# Altium project PCB_Project1.PrjPCB
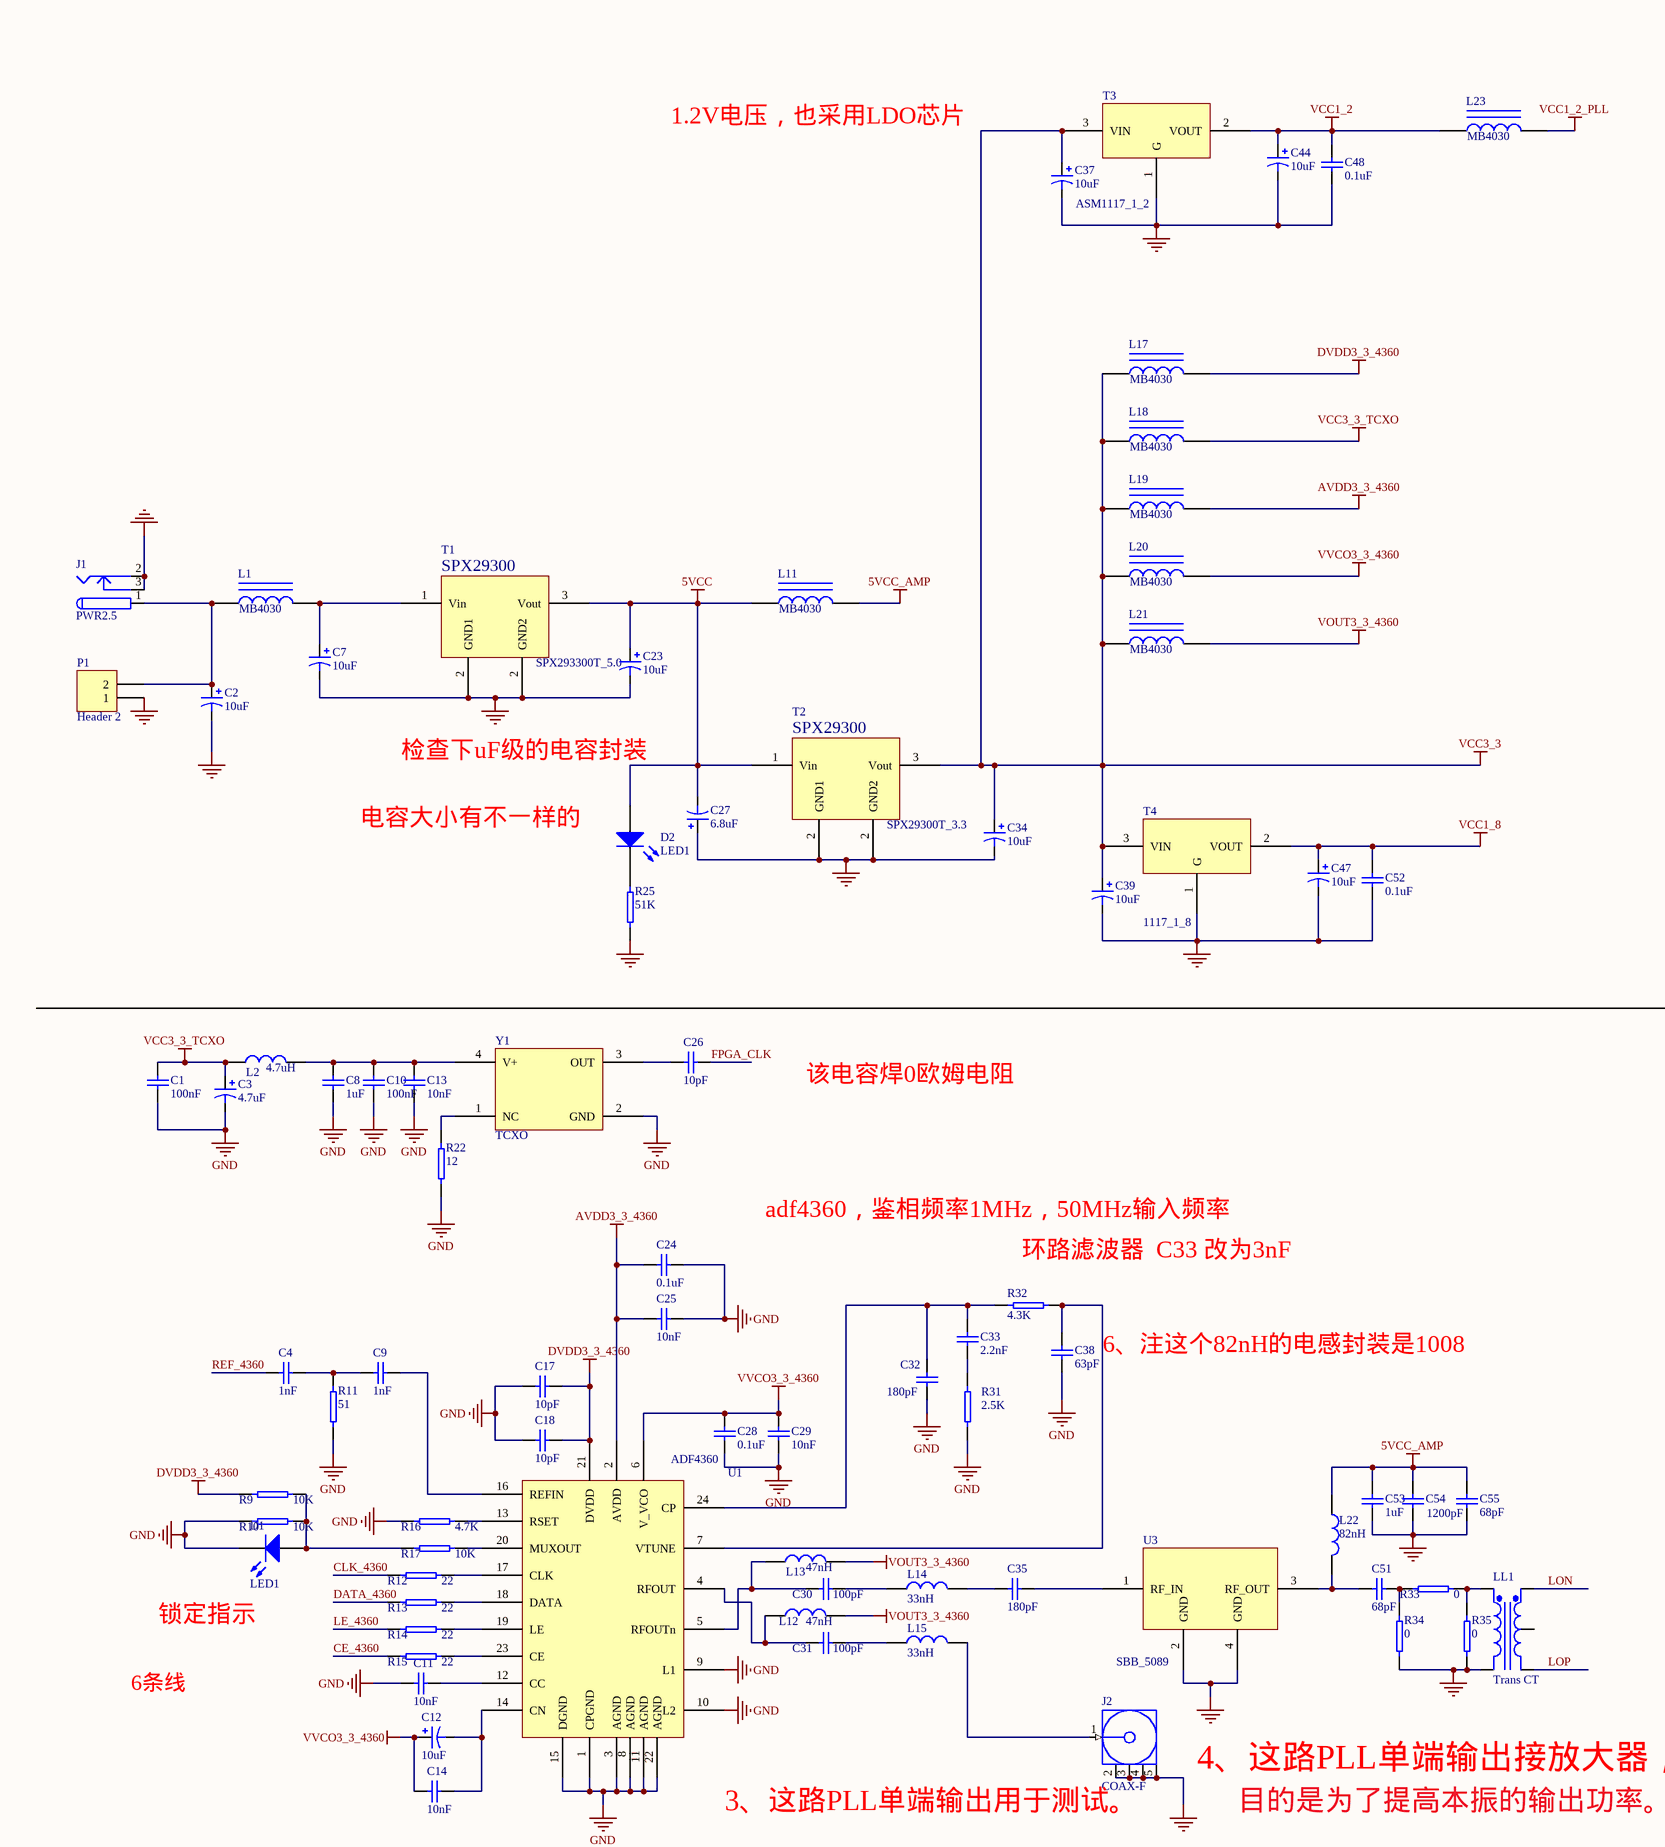
[diagram p0: Sheet1.SchDoc, top left]
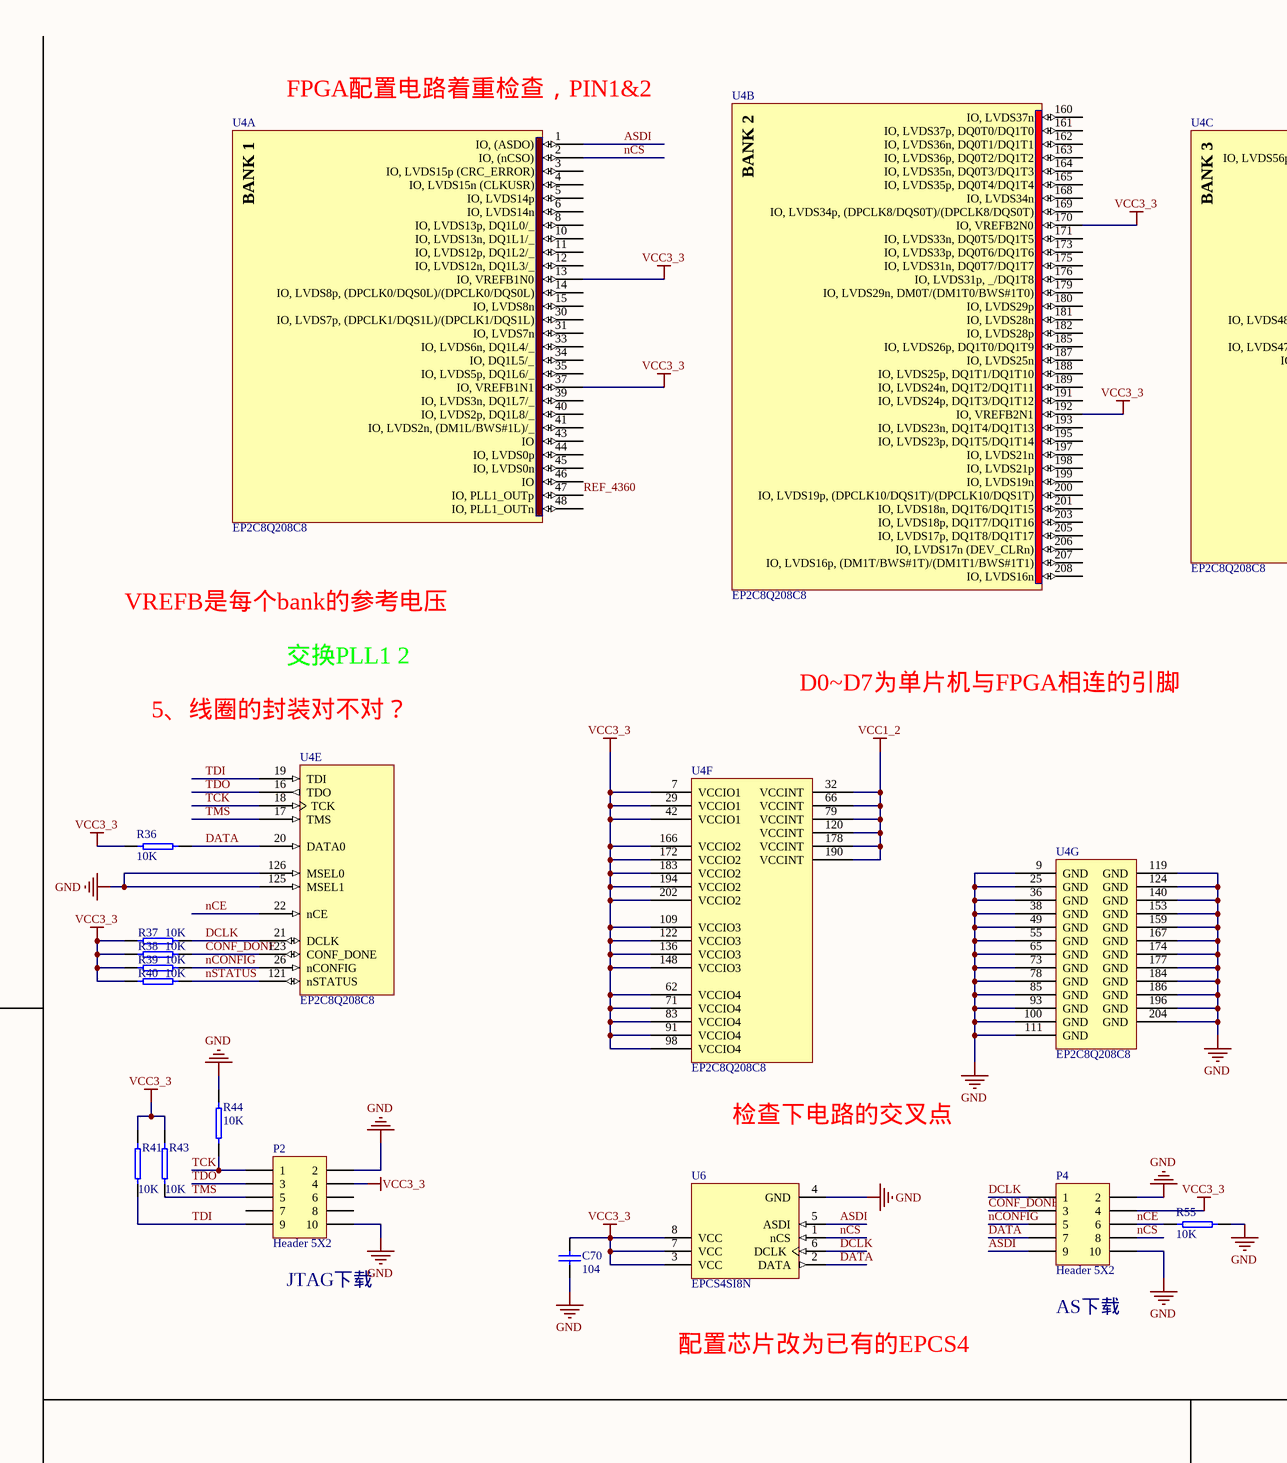
[diagram p1: Sheet1.SchDoc, top middle]
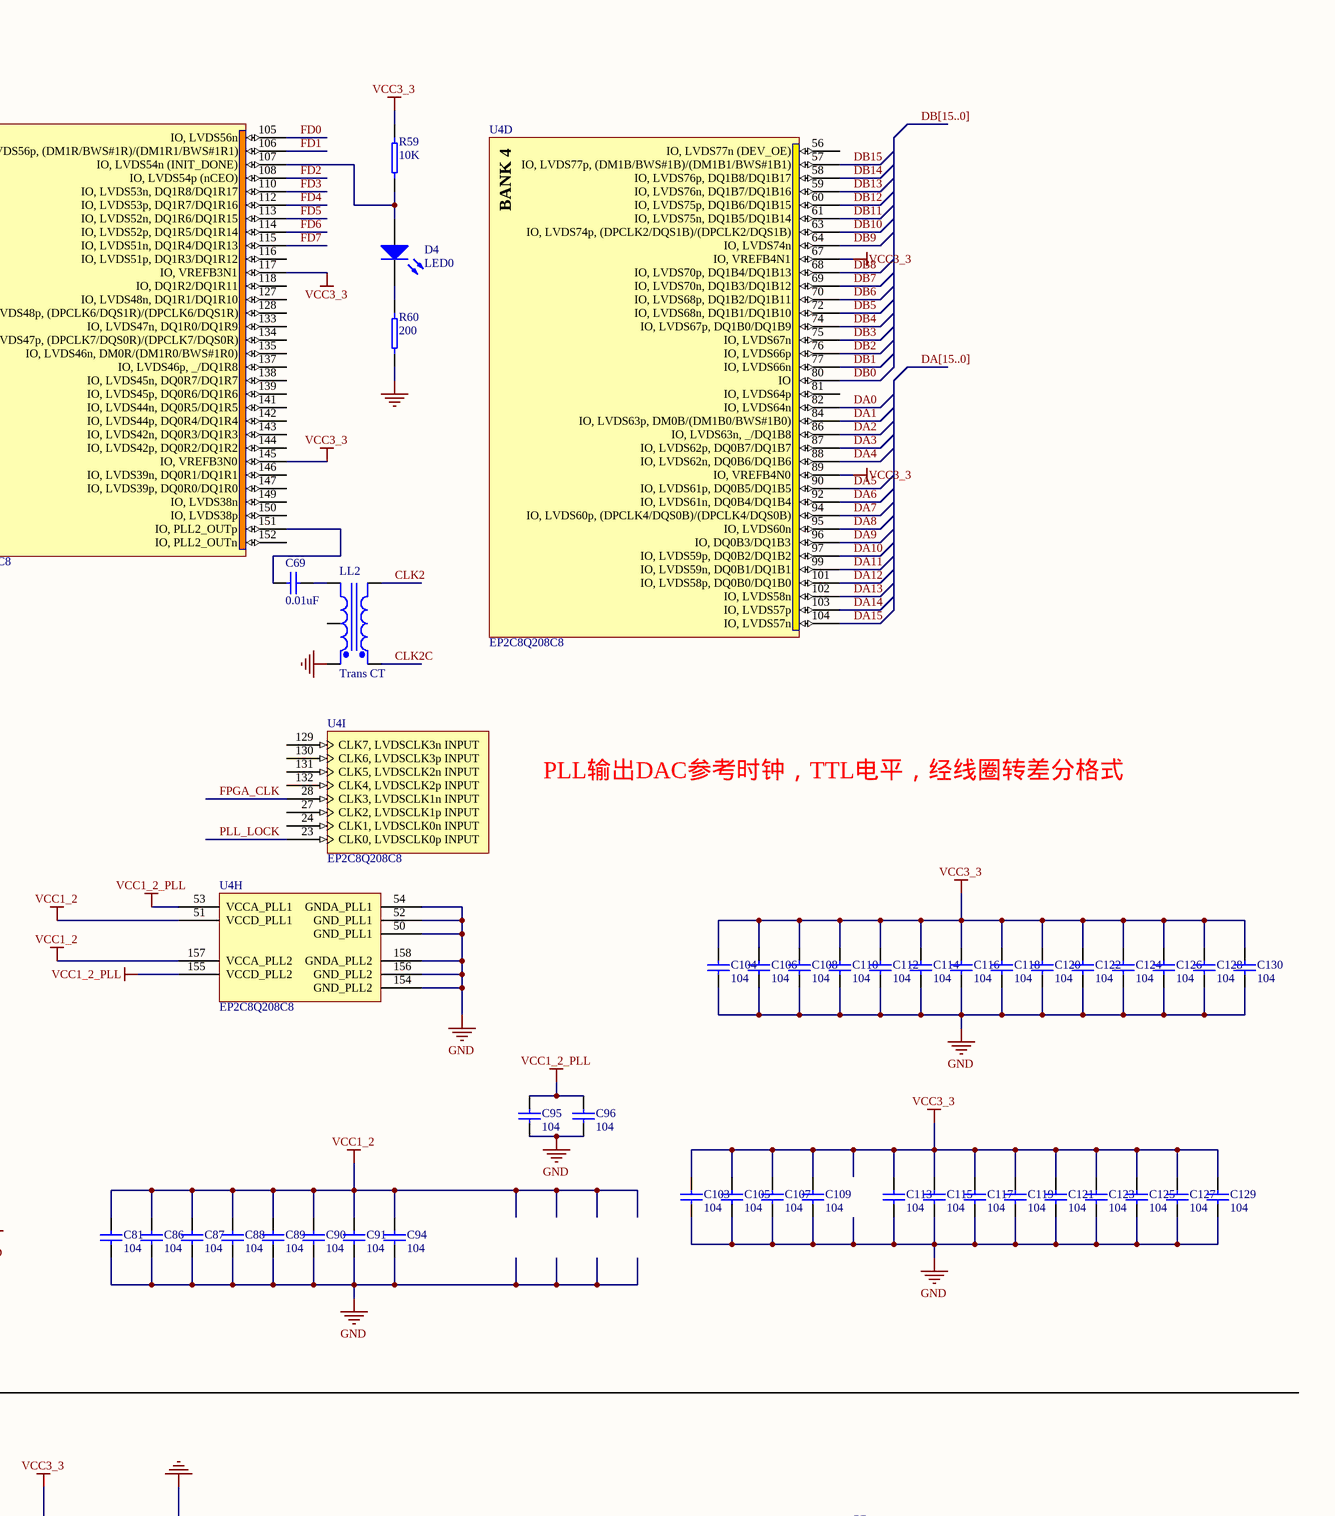
[diagram p2: Sheet1.SchDoc, top right]
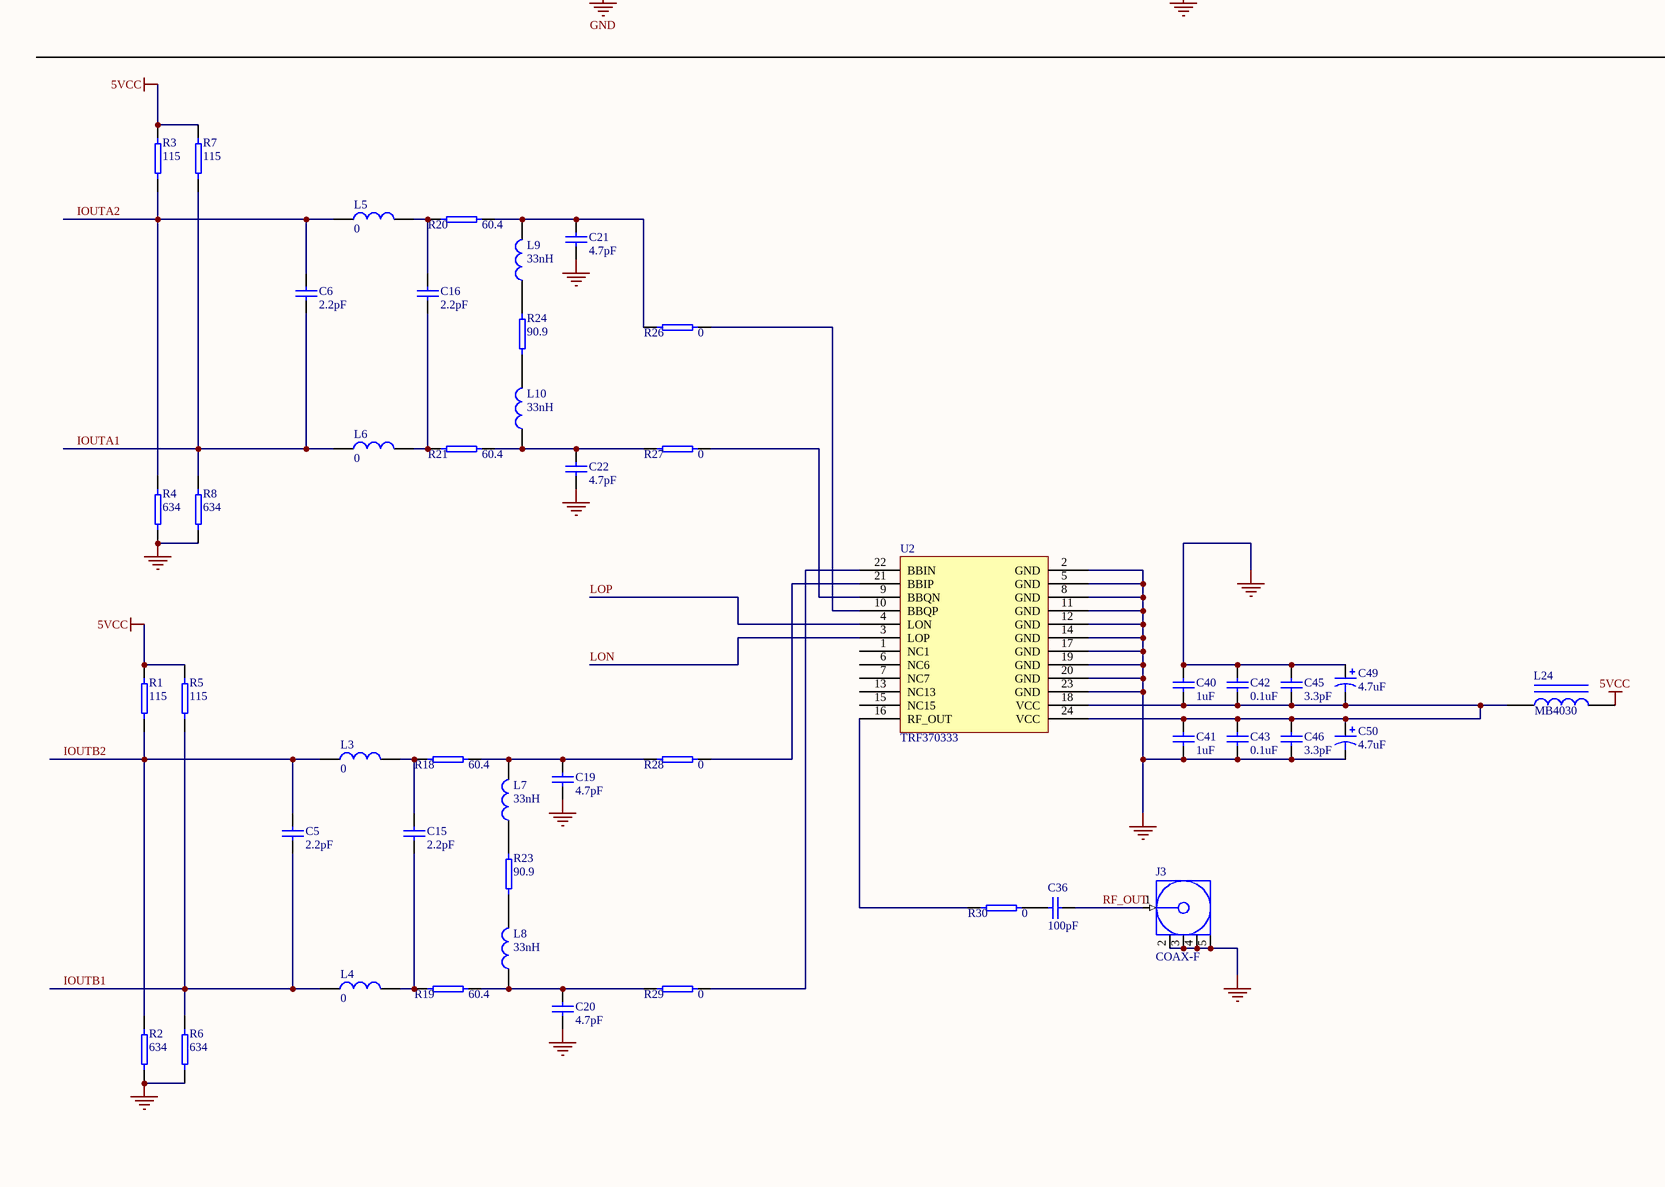
[diagram p3: Sheet1.SchDoc, bottom left]
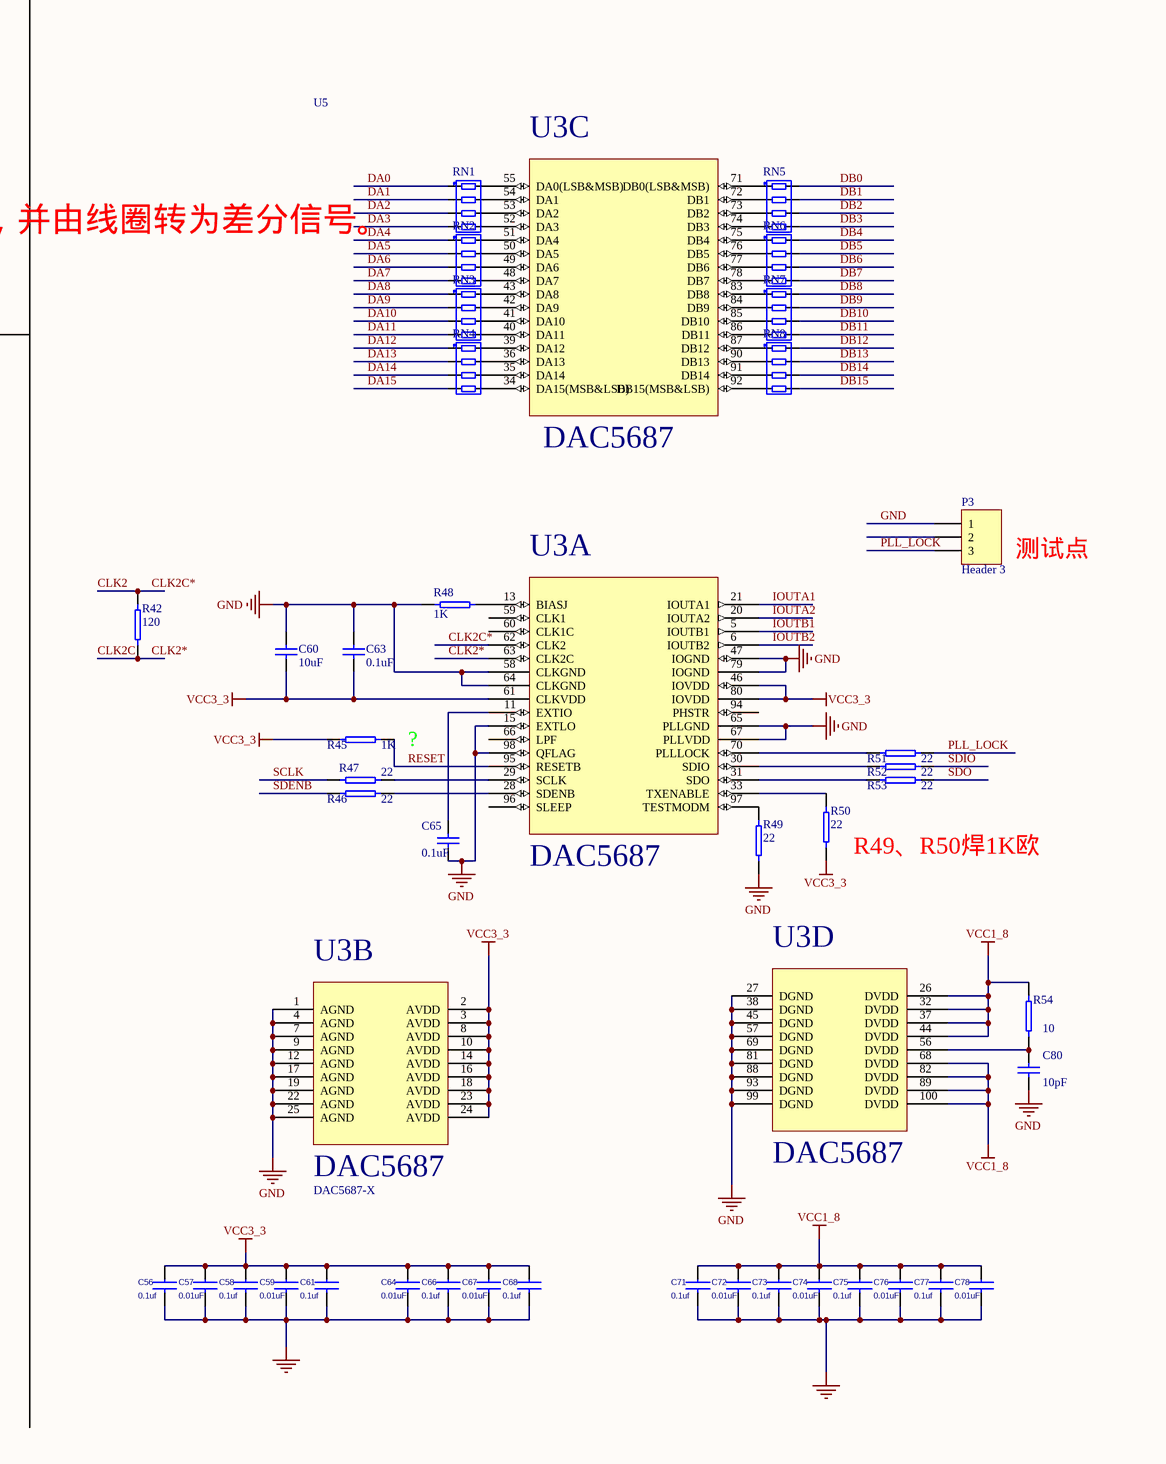
[diagram p4: Sheet1.SchDoc, bottom middle]
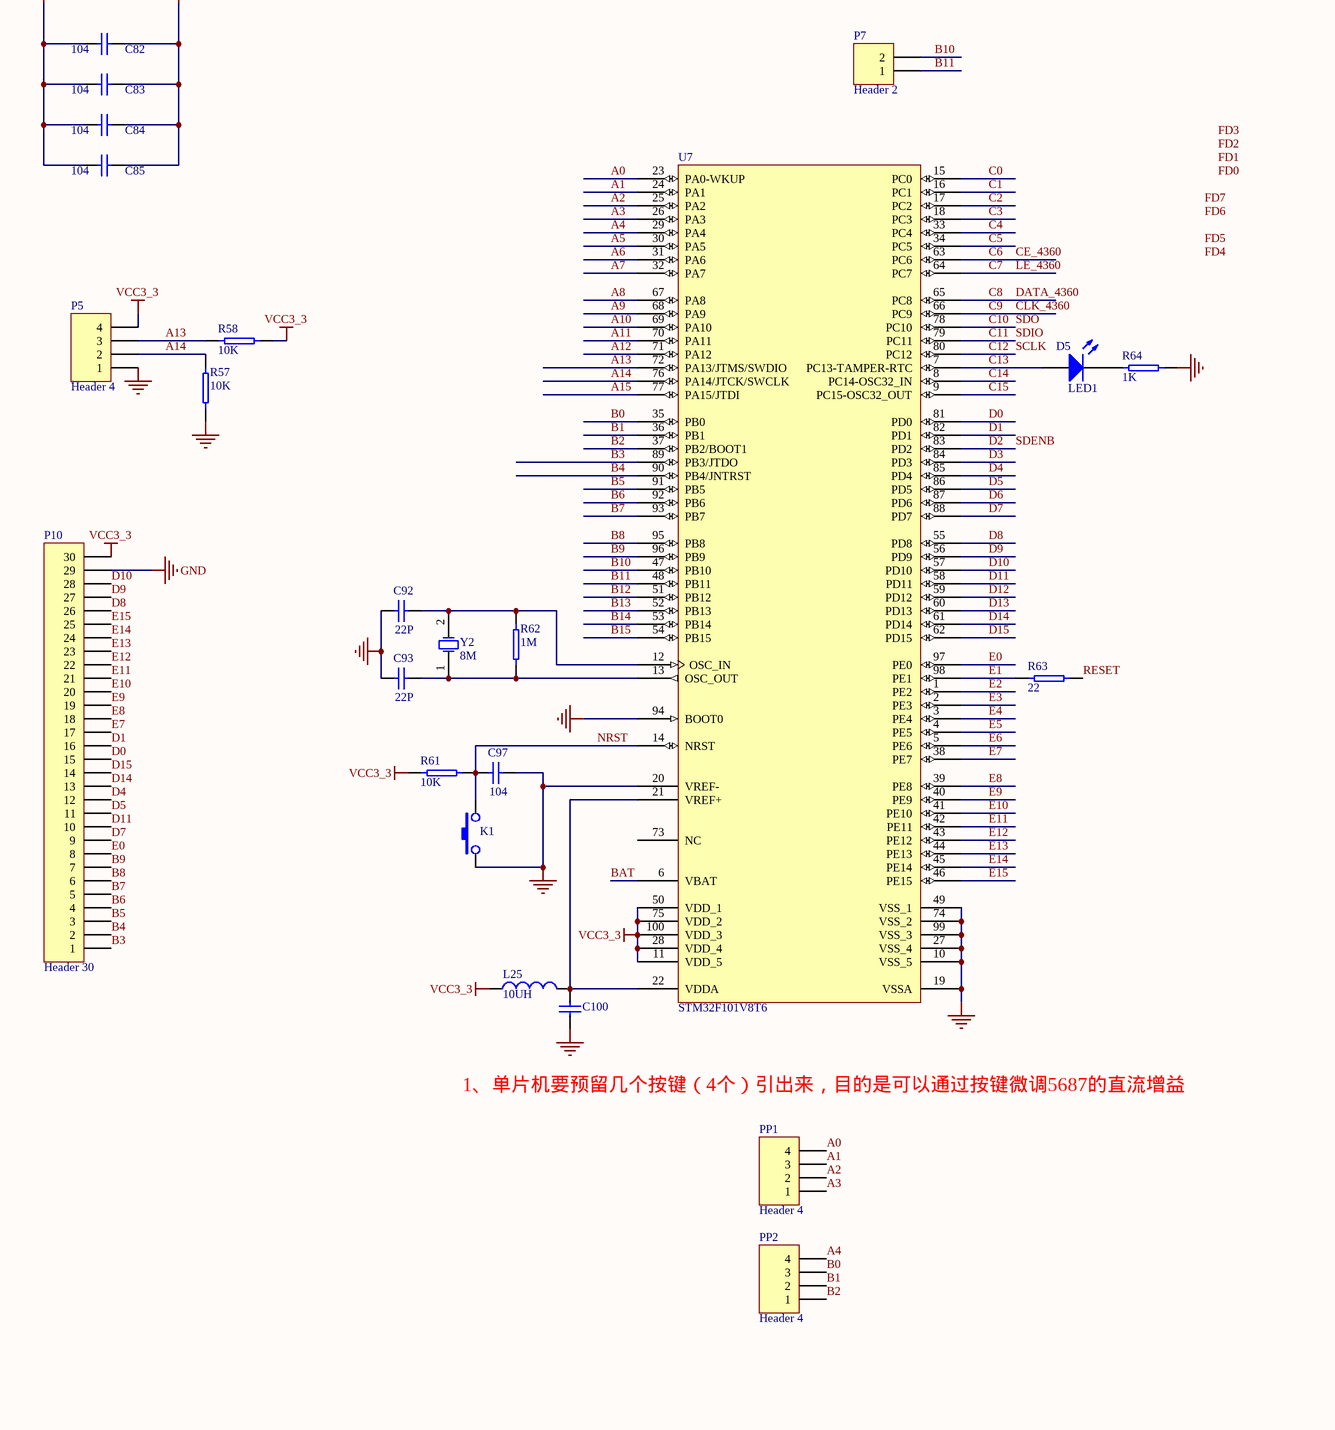
[diagram p5: Sheet1.SchDoc, bottom right]
1 sheet, 250 parts. Net scope: global (net labels, ports and power ports of the same name join across sheets).
Board file: PCB1.PcbDoc

## Sheet Sheet1.SchDoc
size A1

### Parts
C1  value 100nF  [0805C]  (hidden comment: Cap)
C2  10uF  [1206]
C3  4.7uF  [1206]
C4  value 1nF  [0805C]  (hidden comment: Cap)
C5  value 2.2pF  [0805C]  (hidden comment: Cap)
C6  value 2.2pF  [0805C]  (hidden comment: Cap)
C7  10uF  [1206]
C8  value 1uF  [0805C]  (hidden comment: Cap)
C9  value 1nF  [0805C]  (hidden comment: Cap)
C10  value 100nF  [0805C]  (hidden comment: Cap)
C11  value 10nF  [0805C]  (hidden comment: Cap)
C12  10uF  [1206]
C13  value 10nF  [0805C]  (hidden comment: Cap)
C14  value 10nF  [0805C]  (hidden comment: Cap)
C15  value 2.2pF  [0805C]  (hidden comment: Cap)
C16  value 2.2pF  [0805C]  (hidden comment: Cap)
C17  value 10pF  [0805C]  (hidden comment: Cap)
C18  value 10pF  [0805C]  (hidden comment: Cap)
C19  value 4.7pF  [0805C]  (hidden comment: Cap)
C20  value 4.7pF  [0805C]  (hidden comment: Cap)
C21  value 4.7pF  [0805C]  (hidden comment: Cap)
C22  value 4.7pF  [0805C]  (hidden comment: Cap)
C23  10uF  [1206]
C24  value 0.1uF  [0805C]  (hidden comment: Cap)
C25  value 10nF  [0805C]  (hidden comment: Cap)
C26  value 10pF  [0805C]  (hidden comment: Cap)
C27  6.8uF  [1206]
C28  value 0.1uF  [0805C]  (hidden comment: Cap)
C29  value 10nF  [0805C]  (hidden comment: Cap)
C30  value 100pF  [0805C]  (hidden comment: Cap)
C31  value 100pF  [0805C]  (hidden comment: Cap)
C32  value 180pF  [0805C]  (hidden comment: Cap)
C33  value 2.2nF  [0805C]  (hidden comment: Cap)
C34  10uF  [1206]
C35  value 180pF  [0805C]  (hidden comment: Cap)
C36  value 100pF  [0805C]  (hidden comment: Cap)
C37  10uF  [1206]
C38  value 63pF  [0805C]  (hidden comment: Cap)
C39  10uF  [1206]
C40  value 1uF  [0805C]  (hidden comment: Cap)
C41  value 1uF  [0805C]  (hidden comment: Cap)
C42  value 0.1uF  [0805C]  (hidden comment: Cap)
C43  value 0.1uF  [0805C]  (hidden comment: Cap)
C44  10uF  [1206]
C45  value 3.3pF  [0805C]  (hidden comment: Cap)
C46  value 3.3pF  [0805C]  (hidden comment: Cap)
C47  10uF  [1206]
C48  value 0.1uF  [0805C]  (hidden comment: Cap)
C49  4.7uF  [1206]
C50  4.7uF  [1206]
C51  value 68pF  [0805C]  (hidden comment: Cap)
C52  value 0.1uF  [0805C]  (hidden comment: Cap)
C53  value 1uF  [0805C]  (hidden comment: Cap)
C54  value 1200pF  [0805C]  (hidden comment: Cap)
C55  value 68pF  [0805C]  (hidden comment: Cap)
C56  0.1uf  [0603]
C57  0.01uF  [0603]
C58  0.1uf  [0603]
C59  0.01uF  [0603]
C60  value 10uF  [0805C]  (hidden comment: Cap)
C61  0.1uf  [0603]
C63  value 0.1uF  [0805C]  (hidden comment: Cap)
C64  0.01uF  [0603]
C65  value 0.1uF  [0805C]  (hidden comment: Cap)
C66  0.1uf  [0603]
C67  0.01uF  [0603]
C68  0.1uf  [0603]
C69  value 0.01uF  [0805C]  (hidden comment: Cap)
C70  value 104  [0805C]  (hidden comment: Cap)
C71  0.1uf  [0603]
C72  0.01uF  [0603]
C73  0.1uf  [0603]
C74  0.01uF  [0603]
C75  0.1uf  [0603]
C76  0.01uF  [0603]
C77  0.1uf  [0603]
C78  0.01uF  [0603]
C80  value 10pF  [0805C]  (hidden comment: Cap)
C81  value 104  [0603]  (hidden comment: Cap)
C82  104  [0805C]
C83  104  [0805C]
C84  104  [0805C]
C85  104  [0805C]
C86  value 104  [0603]  (hidden comment: Cap)
C87  value 104  [0603]  (hidden comment: Cap)
C88  value 104  [0603]  (hidden comment: Cap)
C89  value 104  [0603]  (hidden comment: Cap)
C90  value 104  [0603]  (hidden comment: Cap)
C91  value 104  [0603]  (hidden comment: Cap)
C92  value 22P  [0805C]  (hidden comment: Cap)
C93  value 22P  [0805C]  (hidden comment: Cap)
C94  value 104  [0603]  (hidden comment: Cap)
C95  value 104  [0603]  (hidden comment: Cap)
C96  value 104  [0603]  (hidden comment: Cap)
C97  value 104  [0805C]  (hidden comment: Cap)
C100  Cap  [0805C]  (value not drawn)
C103  value 104  [0603]  (hidden comment: Cap)
C104  value 104  [0603]  (hidden comment: Cap)
C105  value 104  [0603]  (hidden comment: Cap)
C106  value 104  [0603]  (hidden comment: Cap)
C107  value 104  [0603]  (hidden comment: Cap)
C108  value 104  [0603]  (hidden comment: Cap)
C109  value 104  [0603]  (hidden comment: Cap)
C110  value 104  [0603]  (hidden comment: Cap)
C112  value 104  [0603]  (hidden comment: Cap)
C113  value 104  [0603]  (hidden comment: Cap)
C114  value 104  [0603]  (hidden comment: Cap)
C115  value 104  [0603]  (hidden comment: Cap)
C116  value 104  [0603]  (hidden comment: Cap)
C117  value 104  [0603]  (hidden comment: Cap)
C118  value 104  [0603]  (hidden comment: Cap)
C119  value 104  [0603]  (hidden comment: Cap)
C120  value 104  [0603]  (hidden comment: Cap)
C121  value 104  [0603]  (hidden comment: Cap)
C122  value 104  [0603]  (hidden comment: Cap)
C123  value 104  [0603]  (hidden comment: Cap)
C124  value 104  [0603]  (hidden comment: Cap)
C125  value 104  [0603]  (hidden comment: Cap)
C126  value 104  [0603]  (hidden comment: Cap)
C127  value 104  [0603]  (hidden comment: Cap)
C128  value 104  [0603]  (hidden comment: Cap)
C129  value 104  [0603]  (hidden comment: Cap)
C130  value 104  [0603]  (hidden comment: Cap)
D1  LED1  [0805D]
D2  LED1  [0805D]
D4  LED0  [0805D]
D5  LED1  [0805D]
J1  PWR2.5  [DS-3]
J2  COAX-F  [MCX5.08-H5]
J3  COAX-F  [MCX5.08-H5]
K1  BUTTON  [k1]  (value not drawn)
L1  value MB4030  [0805L]  (hidden comment: Inductor Iron)
L2  4.7uH  [0805L]
L3  0  [0805L]
L4  0  [0805L]
L5  0  [0805L]
L6  0  [0805L]
L7  33nH  [0805L]
L8  33nH  [0805L]
L9  33nH  [0805L]
L10  33nH  [0805L]
L11  value MB4030  [0805L]  (hidden comment: Inductor Iron)
L12  47nH  [0805L]
L13  47nH  [0805L]
L14  33nH  [0805L]
L15  33nH  [0805L]
L17  value MB4030  [0805L]  (hidden comment: Inductor Iron)
L18  value MB4030  [0805L]  (hidden comment: Inductor Iron)
L19  value MB4030  [0805L]  (hidden comment: Inductor Iron)
L20  value MB4030  [0805L]  (hidden comment: Inductor Iron)
L21  value MB4030  [0805L]  (hidden comment: Inductor Iron)
L22  82nH  [0805L]
L23  value MB4030  [0805L]  (hidden comment: Inductor Iron)
L24  value MB4030  [0805L]  (hidden comment: Inductor Iron)
L25  value 10UH  [0805L]  (hidden comment: Inductor)
LL1  Trans CT  [SOT23-5]
LL2  Trans CT  [SOT23-5]
P1  Header 2  [SIP2-T0]
P2  Header 5X2  [IDC5]
P3  Header 3  [SIP3-T0]
P4  Header 5X2  [IDC5]
P5  Header 4  [SIP4-T0]
P7  Header 2  [SIP2-T0]
P10  Header 30  [FFC_30P_0.5MM]
PP1  Header 4  [SIP4-T0]
PP2  Header 4  [SIP4-T0]
R1  115  [0805]
R2  634  [0805]
R3  115  [0805]
R4  634  [0805]
R5  115  [0805]
R6  634  [0805]
R7  115  [0805]
R8  634  [0805]
R9  10K  [0805]
R10  10K  [0805]
R11  51  [0805]
R12  22  [0805]
R13  22  [0805]
R14  22  [0805]
R15  22  [0805]
R16  4.7K  [0805]
R17  10K  [0805]
R18  60.4  [0805]
R19  60.4  [0805]
R20  60.4  [0805]
R21  60.4  [0805]
R22  12  [0805]
R23  90.9  [0805]
R24  90.9  [0805]
R25  51K  [0805]
R26  0  [0805]
R27  0  [0805]
R28  0  [0805]
R29  0  [0805]
R30  0  [0805]
R31  2.5K  [0805]
R32  4.3K  [0805]
R33  0  [0805]
R34  0  [0805]
R35  0  [0805]
R36  10K  [0805]
R37  10K  [0805]
R38  10K  [0805]
R39  10K  [0805]
R40  10K  [0805]
R41  10K  [0805]
R42  120  [0805]
R43  10K  [0805]
R44  10K  [0805]
R45  1K  [0805]
R46  22  [0805]
R47  22  [0805]
R48  1K  [0805]
R49  22  [0805]
R50  22  [0805]
R51  22  [0805]
R52  22  [0805]
R53  22  [0805]
R54  10  [0805]
R55  10K  [0805]
R57  10K  [0805]
R58  10K  [0805]
R59  10K  [0805]
R60  200  [0805]
R61  10K  [0805]
R62  1M  [0805]
R63  22  [0805]
R64  1K  [0805]
RN1  RES*4  [0603*4反]  (value not drawn)
RN2  RES*4  [0603*4反]  (value not drawn)
RN3  RES*4  [0603*4反]  (value not drawn)
RN4  RES*4  [0603*4反]  (value not drawn)
RN5  RES*4  [0603*4反]  (value not drawn)
RN6  RES*4  [0603*4反]  (value not drawn)
RN7  RES*4  [0603*4反]  (value not drawn)
RN8  RES*4  [0603*4反]  (value not drawn)
T1  SPX293300T_5.0  [TO-263]
T2  SPX29300T_3.3  [TO-263]
T3  ASM1117_1_2  [SOT-223]
T4  1117_1_8  [SOT-223]
U1  ADF4360  [QFN24]
U2  TRF370333  [QFN24]
U3  SBB_5089  [SBB_5089]
U4  EP2C8Q208C8  [FPGA208]  (parts A,B,C,D,E,F,G,H,I of 9)
U5  DAC5687-X  [TQFP100]
U6  EPCS4SI8N  [SOP8]
U7  STM32F101V8T6  [TQFP100]
Y1  TCXO  [晶振7050]
Y2  8M  [晶振-1]

### Nets
5VCC: C23.1 C27.2 D2.1(A) L11.1 L24.2 R1.1 R3.1 R5.1 R7.1 T1.3(Vout) T2.1(Vin)
5VCC_AMP: C53.2 C54.2 C55.2 L11.2 L22.1
AVDD3_3_4360: C24.2 C25.2 L19.2 U1.2(AVDD)
DVDD3_3_4360: C17.1 C18.1 L17.2 R9.2 U1.21(DVDD)
GND: C1.1 C2.2 C3.2 C7.2 C8.1 C10.2 C11.2 C13.2 C17.2 C18.2 C19.1 C20.1 C21.1 C22.1 C23.2 C24.1 C25.1 C27.1 C28.2 C29.2 C32.2 C34.2 C37.2 C38.2 C39.2 C40.1 C41.2 C42.1 C43.2 C44.2 C45.1 C46.2 C47.2 C48.1 C49.1 C50.2 C52.1 C53.1 C54.1 C55.1 C56.2 C57.2 C58.2 C59.2 C60.1 C61.2 C63.1 C64.2 C65.1 C66.2 C67.2 C68.2 C70.1 C71.2 C72.2 C73.2 C74.2 C75.2 C76.2 C77.2 C78.2 C80.1 C81.1 C82.1 C83.1 C84.1 C85.1 C86.1 C87.1 C88.1 C89.1 C90.1 C91.1 C92.1 C93.1 C94.1 C95.1 C96.1 C97.2 C100.2 C103.1 C104.1 C105.1 C106.1 C107.1 C108.1 C109.1 C110.1 C112.1 C113.1 C114.1 C115.1 C116.1 C117.1 C118.1 C119.1 C120.1 C121.1 C122.1 C123.1 C124.1 C125.1 C126.1 C127.1 C128.1 C129.1 C130.1 D1.2(K) J1.2 J1.3 J2.2(GND) J2.3(GND) J2.4(GND) J2.5(GND) J3.2(GND) J3.3(GND) J3.4(GND) J3.5(GND) K1.1 LL1.4(Pri-) LL2.3(Sec+) P1.1 P2.2 P2.10 P3.1 P4.2 P4.10 P5.1 P10.29 R2.2 R4.2 R6.2 R8.2 R10.2 R11.2 R16.2 R22.2 R25.1 R31.2 R34.2 R35.2 R44.1 R48.2 R49.2 R55.1 R57.2 R60.1 R64.2 T1.2(GND1) T2.2(GND1) T3.1(G) T4.1(G) U1.1(CPGND) U1.3(AGND) U1.8(AGND) U1.9(L1) U1.10(L2) U1.11(AGND) U1.15(DGND) U1.22(AGND) U2.2(GND) U2.5(GND) U2.8(GND) U2.11(GND) U2.12(GND) U2.14(GND) U2.17(GND) U2.19(GND) U2.20(GND) U2.23(GND) U3.2(GND) U3.4(GND) U4.9(GND) U4.25(GND) U4.36(GND) U4.38(GND) U4.49(GND) U4.50(GND_PLL1) U4.52(GND_PLL1) U4.54(GNDA_PLL1) U4.55(GND) U4.65(GND) U4.73(GND) U4.78(GND) U4.85(GND) U4.93(GND) U4.100(GND) U4.111(GND) U4.119(GND) U4.124(GND) U4.125(MSEL1) U4.126(MSEL0) U4.140(GND) U4.153(GND) U4.154(GND_PLL2) U4.156(GND_PLL2) U4.158(GNDA_PLL2) U4.159(GND) U4.167(GND) U4.174(GND) U4.177(GND) U4.184(GND) U4.186(GND) U4.196(GND) U4.204(GND) U5.1(AGND) U5.4(AGND) U5.7(AGND) U5.9(AGND) U5.12(AGND) U5.15(EXTLO) U5.17(AGND) U5.19(AGND) U5.22(AGND) U5.25(AGND) U5.27(DGND) U5.38(DGND) U5.45(DGND) U5.47(IOGND) U5.57(DGND) U5.58(CLKGND) U5.64(CLKGND) U5.65(PLLGND) U5.67(PLLVDD) U5.69(DGND) U5.79(IOGND) U5.81(DGND) U5.88(DGND) U5.93(DGND) U5.98(QFLAG) U5.99(DGND) U6.4(GND) U7.10(VSS_5) U7.19(VSSA) U7.20(VREF-) U7.27(VSS_4) U7.49(VSS_1) U7.74(VSS_2) U7.94(BOOT0) U7.99(VSS_3) Y1.2(GND)
VCC1_2: C44.1 C48.2 C81.2 C86.2 C87.2 C88.2 C89.2 C90.2 C91.2 C94.2 L23.1 T3.2(VOUT) U4.32(VCCINT) U4.51(VCCD_PLL1) U4.66(VCCINT) U4.79(VCCINT) U4.120(VCCINT) U4.157(VCCA_PLL2) U4.178(VCCINT) U4.190(VCCINT)
VCC1_2_PLL: C95.2 C96.2 L23.2 U4.53(VCCA_PLL1) U4.155(VCCD_PLL2)
VCC1_8: C47.1 C52.2 C71.1 C72.1 C73.1 C74.1 C75.1 C76.1 C77.1 C78.1 R54.1 T4.2(VOUT) U5.26(DVDD) U5.32(DVDD) U5.37(DVDD) U5.44(DVDD) U5.68(DVDD) U5.82(DVDD) U5.89(DVDD) U5.100(DVDD)
VCC3_3: C34.1 C37.1 C39.1 C56.1 C57.1 C58.1 C59.1 C60.2 C61.1 C63.2 C64.1 C66.1 C67.1 C68.1 C70.2 C82.2 C83.2 C84.2 C85.2 C103.2 C104.2 C105.2 C106.2 C107.2 C108.2 C109.2 C110.2 C112.2 C113.2 C114.2 C115.2 C116.2 C117.2 C118.2 C119.2 C120.2 C121.2 C122.2 C123.2 C124.2 C125.2 C126.2 C127.2 C128.2 C129.2 C130.2 L17.1 L18.1 L19.1 L20.1 L21.1 L25.1 P2.4 P4.4 P5.4 P10.30 R36.2 R37.2 R38.2 R39.2 R40.2 R41.1 R43.2 R45.2 R50.2 R58.1 R59.2 R61.2 T2.3(Vout) T3.3(VIN) T4.3(VIN) U4.7(VCCIO1) U4.13(IO,_VREFB1N0) U4.29(VCCIO1) U4.37(IO,_VREFB1N1) U4.42(VCCIO1) U4.62(VCCIO4) U4.67(IO,_VREFB4N1) U4.71(VCCIO4) U4.83(VCCIO4) U4.89(IO,_VREFB4N0) U4.91(VCCIO4) U4.98(VCCIO4) U4.109(VCCIO3) U4.117(IO,_VREFB3N1) U4.122(VCCIO3) U4.136(VCCIO3) U4.145(IO,_VREFB3N0) U4.148(VCCIO3) U4.166(VCCIO2) U4.170(IO,_VREFB2N0) U4.172(VCCIO2) U4.183(VCCIO2) U4.192(IO,_VREFB2N1) U4.194(VCCIO2) U4.202(VCCIO2) U5.2(AVDD) U5.3(AVDD) U5.8(AVDD) U5.10(AVDD) U5.14(AVDD) U5.16(AVDD) U5.18(AVDD) U5.23(AVDD) U5.24(AVDD) U5.46(IOVDD) U5.61(CLKVDD) U5.80(IOVDD) U6.3(VCC) U6.7(VCC) U6.8(VCC) U7.11(VDD_5) U7.28(VDD_4) U7.50(VDD_1) U7.75(VDD_2) U7.100(VDD_3)
VCC3_3_TCXO: C1.2 C3.1 L2.1 L18.2
VOUT3_3_4360: L12.2 L13.2 L21.2
VVCO3_3_4360: C12.1 C14.1 C28.1 C29.1 L20.2 U1.6(V_VCO)
A0: PP1.4 U7.23(PA0-WKUP)
A1: PP1.3 U7.24(PA1)
A2: PP1.2 U7.25(PA2)
A3: PP1.1 U7.26(PA3)
A4: PP2.4 U7.29(PA4)
A5: U7.30(PA5)
A6: U7.31(PA6)
A7: U7.32(PA7)
A8: U7.67(PA8)
A9: U7.68(PA9)
A10: U7.69(PA10)
A11: U7.70(PA11)
A12: U7.71(PA12)
A13: P5.3 R58.2 U7.72(PA13/JTMS/SWDIO)
A14: P5.2 R57.1 U7.76(PA14/JTCK/SWCLK)
A15: U7.77(PA15/JTDI)
ASDI: P4.9 U4.1(IO,_(ASDO)) U6.5(ASDI)
B0: PP2.3 U7.35(PB0)
B1: PP2.2 U7.36(PB1)
B2: PP2.1 U7.37(PB2/BOOT1)
B3: P10.1 U7.89(PB3/JTDO)
B4: P10.2 U7.90(PB4/JNTRST)
B5: P10.3 U7.91(PB5)
B6: P10.4 U7.92(PB6)
B7: P10.5 U7.93(PB7)
B8: P10.6 U7.95(PB8)
B9: P10.7 U7.96(PB9)
B10: P7.2 U7.47(PB10)
B11: P7.1 U7.48(PB11)
B12: U7.51(PB12)
B13: U7.52(PB13)
B14: U7.53(PB14)
B15: U7.54(PB15)
BAT: U7.6(VBAT)
C0: U7.15(PC0)
C1: U7.16(PC1)
C2: U7.17(PC2)
C3: U7.18(PC3)
C4: U7.33(PC4)
C5: U7.34(PC5)
C6: R15.2 U7.63(PC6)  [also labelled CE_4360]
C7: R14.2 U7.64(PC7)  [also labelled LE_4360]
C8: R13.2 U7.65(PC8)  [also labelled DATA_4360]
C9: R12.2 U7.66(PC9)  [also labelled CLK_4360]
C10: R53.1 U7.78(PC10)  [also labelled SDO]
C11: R52.1 U7.79(PC11)  [also labelled SDIO]
C12: R47.2 U7.80(PC12)  [also labelled SCLK]
C13: D5.1(A) U7.7(PC13-TAMPER-RTC)
C14: U7.8(PC14-OSC32_IN)
C15: U7.9(PC15-OSC32_OUT)
CLK2: LL2.4(Pri-) R42.1 U5.62(CLK2)  [also labelled CLK2C*]
CLK2*: LL2.5(Pri+) R42.2 U5.63(CLK2C)  [also labelled CLK2C]
CONF_DONE: P4.3 R38.1 U4.123(CONF_DONE)
D0: P10.15 U7.81(PD0)
D1: P10.16 U7.82(PD1)
D2: R46.2 U7.83(PD2)  [also labelled SDENB]
D3: U7.84(PD3)
D4: P10.12 U7.85(PD4)
D5: P10.11 U7.86(PD5)
D6: U7.87(PD6)
D7: P10.9 U7.88(PD7)
D8: P10.26 U7.55(PD8)
D9: P10.27 U7.56(PD9)
D10: P10.28 U7.57(PD10)
D11: P10.10 U7.58(PD11)
D12: U7.59(PD12)
D13: U7.60(PD13)
D14: P10.13 U7.61(PD14)
D15: P10.14 U7.62(PD15)
DA0: RN1.1 U4.82(IO,_LVDS64n)
DA1: RN1.2 U4.84(IO,_LVDS63p,_DM0B/(DM1B0/BWS#1B0))
DA2: RN1.3 U4.86(IO,_LVDS63n,__/DQ1B8)
DA3: RN1.4 U4.87(IO,_LVDS62p,_DQ0B7/DQ1B7)
DA4: RN2.1 U4.88(IO,_LVDS62n,_DQ0B6/DQ1B6)
DA5: RN2.2 U4.90(IO,_LVDS61p,_DQ0B5/DQ1B5)
DA6: RN2.3 U4.92(IO,_LVDS61n,_DQ0B4/DQ1B4)
DA7: RN2.4 U4.94(IO,_LVDS60p,_(DPCLK4/DQS0B)/(DPCLK4/DQS0B))
DA8: RN3.1 U4.95(IO,_LVDS60n)
DA9: RN3.2 U4.96(IO,_DQ0B3/DQ1B3)
DA10: RN3.3 U4.97(IO,_LVDS59p,_DQ0B2/DQ1B2)
DA11: RN3.4 U4.99(IO,_LVDS59n,_DQ0B1/DQ1B1)
DA12: RN4.1 U4.101(IO,_LVDS58p,_DQ0B0/DQ1B0)
DA13: RN4.2 U4.102(IO,_LVDS58n)
DA14: RN4.3 U4.103(IO,_LVDS57p)
DA15: RN4.4 U4.104(IO,_LVDS57n)
DATA: P4.7 R36.1 U4.20(DATA0) U6.2(DATA)
DB0: RN5.8 U4.80(IO)
DB1: RN5.7 U4.77(IO,_LVDS66n)
DB2: RN5.6 U4.76(IO,_LVDS66p)
DB3: RN5.5 U4.75(IO,_LVDS67n)
DB4: RN6.8 U4.74(IO,_LVDS67p,_DQ1B0/DQ1B9)
DB5: RN6.7 U4.72(IO,_LVDS68n,_DQ1B1/DQ1B10)
DB6: RN6.6 U4.70(IO,_LVDS68p,_DQ1B2/DQ1B11)
DB7: RN6.5 U4.69(IO,_LVDS70n,_DQ1B3/DQ1B12)
DB8: RN7.8 U4.68(IO,_LVDS70p,_DQ1B4/DQ1B13)
DB9: RN7.7 U4.64(IO,_LVDS74n)
DB10: RN7.6 U4.63(IO,_LVDS74p,_(DPCLK2/DQS1B)/(DPCLK2/DQS1B))
DB11: RN7.5 U4.61(IO,_LVDS75n,_DQ1B5/DQ1B14)
DB12: RN8.8 U4.60(IO,_LVDS75p,_DQ1B6/DQ1B15)
DB13: RN8.7 U4.59(IO,_LVDS76n,_DQ1B7/DQ1B16)
DB14: RN8.6 U4.58(IO,_LVDS76p,_DQ1B8/DQ1B17)
DB15: RN8.5 U4.57(IO,_LVDS77p,_(DM1B/BWS#1B)/(DM1B1/BWS#1B1))
DCLK: P4.1 R37.1 U4.21(DCLK) U6.6(DCLK)
E0: P10.8 U7.97(PE0)
E1: R63.1 U7.98(PE1)
E2: U7.1(PE2)
E3: U7.2(PE3)
E4: U7.3(PE4)
E5: U7.4(PE5)
E6: U7.5(PE6)
E7: P10.17 U7.38(PE7)
E8: P10.18 U7.39(PE8)
E9: P10.19 U7.40(PE9)
E10: P10.20 U7.41(PE10)
E11: P10.21 U7.42(PE11)
E12: P10.22 U7.43(PE12)
E13: P10.23 U7.44(PE13)
E14: P10.24 U7.45(PE14)
E15: P10.25 U7.46(PE15)
FD0: U4.105(IO,_LVDS56n)
FD1: U4.106(IO,_LVDS56p,_(DM1R/BWS#1R)/(DM1R1/BWS#1R1))
FD2: U4.108(IO,_LVDS54p_(nCEO))
FD3: U4.110(IO,_LVDS53n,_DQ1R8/DQ1R17)
FD4: U4.112(IO,_LVDS53p,_DQ1R7/DQ1R16)
FD5: U4.113(IO,_LVDS52n,_DQ1R6/DQ1R15)
FD6: U4.114(IO,_LVDS52p,_DQ1R5/DQ1R14)
FD7: U4.115(IO,_LVDS51n,_DQ1R4/DQ1R13)
FPGA_CLK: C26.1 U4.28(CLK3,_LVDSCLK1n_INPUT)
IOUTA1: C6.1 L6.1 R7.2 R8.1 U5.21(IOUTA1)
IOUTA2: C6.2 L5.1 R3.2 R4.1 U5.20(IOUTA2)
IOUTB1: C5.1 L4.1 R5.2 R6.1 U5.5(IOUTB1)
IOUTB2: C5.2 L3.1 R1.2 R2.1 U5.6(IOUTB2)
LON: LL1.3(Sec+) U2.3(LOP)
LOP: LL1.1(Sec-) U2.4(LON)
nCE: P4.6 R55.2 U4.22(nCE)
nCONFIG: P4.5 R39.1 U4.26(nCONFIG)
nCS: P4.8 U4.2(IO,_(nCSO)) U6.1(nCS)
NRST: C97.1 K1.2 R61.1 U7.14(NRST)
nSTATUS: R40.1 U4.121(nSTATUS)
PLL_LOCK: P3.3 R51.1 U4.23(CLK0,_LVDSCLK0p_INPUT)
REF_4360: C4.1 U4.47(IO,_PLL1_OUTp)
RESET: R45.1 R63.2 U5.95(RESETB)
RF_OUT: C36.2 J3.1(Signal)
TCK: P2.1 R44.2 U4.18(TCK)
TDI: P2.9 R41.2 U4.19(TDI)
TDO: P2.3 U4.16(TDO)
TMS: P2.5 R43.1 U4.17(TMS)
NetC2_1: C2.1 J1.1 L1.1 P1.2
NetC4_2: C4.2 C9.2 R11.1
NetC7_1: C7.1 L1.2 T1.1(Vin)
NetC8_2: C8.2 C10.1 C13.1 L2.2 Y1.4(V+)
NetC9_1: C9.1 U1.16(REFIN)
NetC11_1: C11.1 U1.12(CC)
NetC12_2: C12.2 C14.2 U1.14(CN)
NetC15_1: C15.1 L4.2 R19.2
NetC15_2: C15.2 L3.2 R18.2
NetC16_1: C16.1 L6.2 R21.2
NetC16_2: C16.2 L5.2 R20.2
NetC19_2: C19.2 L7.2 R18.1 R28.2
NetC20_2: C20.2 L8.1 R19.1 R29.2
NetC21_2: C21.2 L9.2 R20.1 R26.2
NetC22_2: C22.2 L10.1 R21.1 R27.2
NetC26_2: C26.2 Y1.3(OUT)
NetC30_1: C30.1 L14.1
NetC30_2: C30.2 L13.1 U1.5(RFOUTn)
NetC31_1: C31.1 L15.1
NetC31_2: C31.2 L12.1 U1.4(RFOUT)
NetC32_1: C32.1 C33.1 R32.1 U1.24(CP)
NetC33_2: C33.2 R31.1
NetC35_1: C35.1 L14.2
NetC35_2: C35.2 U3.1(RF_IN)
NetC36_1: C36.1 R30.1
NetC38_1: C38.1 R32.2 U1.7(VTUNE)
NetC40_2: C40.2 C41.1 C42.2 C43.1 C45.2 C46.1 C49.2 C50.1 L24.1 U2.18(VCC) U2.24(VCC)
NetC51_1: C51.1 R33.2 R34.1
NetC51_2: C51.2 L22.2 U3.3(RF_OUT)
NetC65_2: C65.2 U5.11(EXTIO)
NetC69_1: C69.1 LL2.1(Sec-)
NetC69_2: C69.2 U4.151(IO,_PLL2_OUTp)
NetC80_2: C80.2 R54.2 U5.56(DVDD)
NetC92_2: C92.2 R62.2 U7.12(OSC_IN) Y2.2(OSC2)
NetC93_2: C93.2 R62.1 U7.13(OSC_OUT) Y2.1(OSC1)
NetC100_1: C100.1 L25.2 U7.21(VREF+) U7.22(VDDA)
NetD1_1: D1.1(A) R9.1 R10.1 R17.2
NetD2_2: D2.2(K) R25.2
NetD4_1: D4.1(A) R59.1 U4.107(IO,_LVDS54n_(INIT_DONE))
NetD4_2: D4.2(K) R60.2
NetD5_2: D5.2(K) R64.1
NetJ2_1: J2.1(Signal) L15.2
NetL7_1: L7.1 R23.1
NetL8_2: L8.2 R23.2
NetL9_1: L9.1 R24.1
NetL10_2: L10.2 R24.2
NetLL1_5: LL1.5(Pri+) R33.1 R35.1
NetR12_1: R12.1 U1.17(CLK)
NetR13_1: R13.1 U1.18(DATA)
NetR14_1: R14.1 U1.19(LE)
NetR15_1: R15.1 U1.23(CE)
NetR16_1: R16.1 U1.13(RSET)
NetR17_1: R17.1 U1.20(MUXOUT)
NetR22_1: R22.1 Y1.1(NC)
NetR26_1: R26.1 U2.10(BBQP)
NetR27_1: R27.1 U2.9(BBQN)
NetR28_1: R28.1 U2.21(BBIP)
NetR29_1: R29.1 U2.22(BBIN)
NetR30_2: R30.2 U2.16(RF_OUT)
NetR46_1: R46.1 U5.28(SDENB)
NetR47_1: R47.1 U5.29(SCLK)
NetR48_1: R48.1 U5.13(BIASJ)
NetR49_1: R49.1 U5.97(TESTMODM)
NetR50_1: R50.1 U5.33(TXENABLE)
NetR51_2: R51.2 U5.70(PLLLOCK)
NetR52_2: R52.2 U5.30(SDIO)
NetR53_2: R53.2 U5.31(SDO)
NetRN1_5: RN1.5 U5.52(DA3)
NetRN1_6: RN1.6 U5.53(DA2)
NetRN1_7: RN1.7 U5.54(DA1)
NetRN1_8: RN1.8 U5.55(DA0(LSB&MSB))
NetRN2_5: RN2.5 U5.48(DA7)
NetRN2_6: RN2.6 U5.49(DA6)
NetRN2_7: RN2.7 U5.50(DA5)
NetRN2_8: RN2.8 U5.51(DA4)
NetRN3_5: RN3.5 U5.40(DA11)
NetRN3_6: RN3.6 U5.41(DA10)
NetRN3_7: RN3.7 U5.42(DA9)
NetRN3_8: RN3.8 U5.43(DA8)
NetRN4_5: RN4.5 U5.34(DA15(MSB&LSB))
NetRN4_6: RN4.6 U5.35(DA14)
NetRN4_7: RN4.7 U5.36(DA13)
NetRN4_8: RN4.8 U5.39(DA12)
NetRN5_1: RN5.1 U5.71(DB0(LSB&MSB))
NetRN5_2: RN5.2 U5.72(DB1)
NetRN5_3: RN5.3 U5.73(DB2)
NetRN5_4: RN5.4 U5.74(DB3)
NetRN6_1: RN6.1 U5.75(DB4)
NetRN6_2: RN6.2 U5.76(DB5)
NetRN6_3: RN6.3 U5.77(DB6)
NetRN6_4: RN6.4 U5.78(DB7)
NetRN7_1: RN7.1 U5.83(DB8)
NetRN7_2: RN7.2 U5.84(DB9)
NetRN7_3: RN7.3 U5.85(DB10)
NetRN7_4: RN7.4 U5.86(DB11)
NetRN8_1: RN8.1 U5.87(DB12)
NetRN8_2: RN8.2 U5.90(DB13)
NetRN8_3: RN8.3 U5.91(DB14)
NetRN8_4: RN8.4 U5.92(DB15(MSB&LSB))

Not connected (* = marked no-connect by the designer): LL1 2(SecCT); LL2 2(SecCT); P2 6 7 8; P3 2; U2 1(NC1) 6(NC6) 7(NC7) 13(NC13) 15(NC15); U4 3(IO,_LVDS15p_(CRC_ERROR)) 4(IO,_LVDS15n_(CLKUSR)) 5(IO,_LVDS14p) 6(IO,_LVDS14n) 8(IO,_LVDS13p,_DQ1L0/_) 10(IO,_LVDS13n,_DQ1L1/_) 11(IO,_LVDS12p,_DQ1L2/_) 12(IO,_LVDS12n,_DQ1L3/_) 14(IO,_LVDS8p,_(DPCLK0/DQS0L)/(DPCLK0/DQS0L)) 15(IO,_LVDS8n) 24(CLK1,_LVDSCLK0n_INPUT) 27(CLK2,_LVDSCLK1p_INPUT) 30(IO,_LVDS7p,_(DPCLK1/DQS1L)/(DPCLK1/DQS1L)) 31(IO,_LVDS7n) 33(IO,_LVDS6n,_DQ1L4/_) 34(IO,_DQ1L5/_) 35(IO,_LVDS5p,_DQ1L6/_) 39(IO,_LVDS3n,_DQ1L7/_) 40(IO,_LVDS2p,_DQ1L8/_) 41(IO,_LVDS2n,_(DM1L/BWS#1L)/_) 43(IO) 44(IO,_LVDS0p) 45(IO,_LVDS0n) 46(IO) 48(IO,_PLL1_OUTn) 56(IO,_LVDS77n_(DEV_OE)) 81(IO,_LVDS64p) 116(IO,_LVDS51p,_DQ1R3/DQ1R12) 118(IO,_DQ1R2/DQ1R11) 127(IO,_LVDS48n,_DQ1R1/DQ1R10) 128(IO,_LVDS48p,_(DPCLK6/DQS1R)/(DPCLK6/DQS1R)) 129(CLK7,_LVDSCLK3n_INPUT) 130(CLK6,_LVDSCLK3p_INPUT) 131(CLK5,_LVDSCLK2n_INPUT) 132(CLK4,_LVDSCLK2p_INPUT) 133(IO,_LVDS47n,_DQ1R0/DQ1R9) 134(IO,_LVDS47p,_(DPCLK7/DQS0R)/(DPCLK7/DQS0R)) 135(IO,_LVDS46n,_DM0R/(DM1R0/BWS#1R0)) 137(IO,_LVDS46p,__/DQ1R8) 138(IO,_LVDS45n,_DQ0R7/DQ1R7) 139(IO,_LVDS45p,_DQ0R6/DQ1R6) 141(IO,_LVDS44n,_DQ0R5/DQ1R5) 142(IO,_LVDS44p,_DQ0R4/DQ1R4) 143(IO,_LVDS42n,_DQ0R3/DQ1R3) 144(IO,_LVDS42p,_DQ0R2/DQ1R2) 146(IO,_LVDS39n,_DQ0R1/DQ1R1) 147(IO,_LVDS39p,_DQ0R0/DQ1R0) 149(IO,_LVDS38n) 150(IO,_LVDS38p) 152(IO,_PLL2_OUTn) 160(IO,_LVDS37n) 161(IO,_LVDS37p,_DQ0T0/DQ1T0) 162(IO,_LVDS36n,_DQ0T1/DQ1T1) 163(IO,_LVDS36p,_DQ0T2/DQ1T2) 164(IO,_LVDS35n,_DQ0T3/DQ1T3) 165(IO,_LVDS35p,_DQ0T4/DQ1T4) 168(IO,_LVDS34n) 169(IO,_LVDS34p,_(DPCLK8/DQS0T)/(DPCLK8/DQS0T)) 171(IO,_LVDS33n,_DQ0T5/DQ1T5) 173(IO,_LVDS33p,_DQ0T6/DQ1T6) 175(IO,_LVDS31n,_DQ0T7/DQ1T7) 176(IO,_LVDS31p,__/DQ1T8) 179(IO,_LVDS29n,_DM0T/(DM1T0/BWS#1T0)) 180(IO,_LVDS29p) 181(IO,_LVDS28n) 182(IO,_LVDS28p) 185(IO,_LVDS26p,_DQ1T0/DQ1T9) 187(IO,_LVDS25n) 188(IO,_LVDS25p,_DQ1T1/DQ1T10) 189(IO,_LVDS24n,_DQ1T2/DQ1T11) 191(IO,_LVDS24p,_DQ1T3/DQ1T12) 193(IO,_LVDS23n,_DQ1T4/DQ1T13) 195(IO,_LVDS23p,_DQ1T5/DQ1T14) 197(IO,_LVDS21n) 198(IO,_LVDS21p) 199(IO,_LVDS19n) 200(IO,_LVDS19p,_(DPCLK10/DQS1T)/(DPCLK10/DQS1T)) 201(IO,_LVDS18n,_DQ1T6/DQ1T15) 203(IO,_LVDS18p,_DQ1T7/DQ1T16) 205(IO,_LVDS17p,_DQ1T8/DQ1T17) 206(IO,_LVDS17n_(DEV_CLRn)) 207(IO,_LVDS16p,_(DM1T/BWS#1T)/(DM1T1/BWS#1T1)) 208(IO,_LVDS16n); U5 59(CLK1) 60(CLK1C) 66(LPF) 94(PHSTR) 96(SLEEP); U7 73(NC)

### Buses and harness runs
bus DA[15..0]
bus DB[15..0]

### Notes on the sheet
- 1.2V电压，也采用LDO芯片
- (near U4) FPGA配置电路着重检查，PIN1&2
- VREFB是每个bank的参考电压
- 交换PLL1 2
- 5、线圈的封装对不对？
- D0~D7为单片机与FPGA相连的引脚
- 检查下uF级的电容封装
- PLL输出DAC参考时钟，TTL电平，经线圈转差分格式
- 电容大小有不一样的
- 该电容焊0欧姆电阻
- 检查下电路的交叉点
- adf4360，鉴相频率1MHz，50MHz输入频率
- (near R32) 环路滤波器  C33 改为3nF
- (near P2) JTAG下载
- (near P4) AS下载
- 6、注这个82nH的电感封装是1008
- 配置芯片改为已有的EPCS4
- 锁定指示
- 6条线
- 3、这路PLL单端输出用于测试。
- (near J2) 4、这路PLL单端输出接放大器，并由线圈转为差分信号。
- 目的是为了提高本振的输出功率。
- 测试点
- (near U5) ?
- (near U5) R49、R50焊1K欧
- 1、单片机要预留几个按键（4个）引出来，目的是可以通过按键微调5687的直流增益
- Labels drawn without touching a wire or pin: FD0, FD1, FD2, FD3, FD4, FD5, FD6, FD7
- (in symbol DAC5687-X) U3C; DAC5687; U3A; U3D; U3B
- (in symbol EP2C8Q208C8, part A) BANK 1
- (in symbol EP2C8Q208C8, part B) BANK 2
- (in symbol EP2C8Q208C8, part C) BANK 3
- (in symbol EP2C8Q208C8, part D) BANK 4
- (in symbol SPX29300T) SPX29300

### Library data of the parts
C1 C4-C6 C8-C11 C13-C22 C24-C26 C28-C33 C35 C36 C38 C40-C43 C45 C46 C48 C51-C55 C60 C63 C65 C69 C70 C80 C81 C86-C97 C100 C103-C110 C112-C130 = Cap: Capacitor; Published: 8-Jun-2000; LatestRevisionDate: 17-Jul-2002; LatestRevisionNote: Re-released for DXP Platform.; PackageReference: RAD-0.3; Publisher: Altium Limited
C2 C3 C7 C12 C23 C27 C34 C37 C39 C44 C47 C49 C50 = CAP+
C56-C59 C61 C64 C66-C68 C71-C78 = CAP NP_Dup3: ROOM: dac
C82-C85 = Cap: Capacitor; Value: 22P; Published: 8-Jun-2000; LatestRevisionDate: 17-Jul-2002; LatestRevisionNote: Re-released for DXP Platform.; PackageReference: RAD-0.3; Publisher: Altium Limited
D1 D2 D4 D5 = LED0: Typical INFRARED GaAs LED; Published: 8-Jun-2000; LatestRevisionDate: 08-Jul-2005; LatestRevisionNote: Mech Layer 1 removed.; PackageReference: LED-0; Publisher: Altium Limited
J1 = PWR2.5: Low Voltage Power Supply Connector; Published: 17-Dec-2003; DatasheetDocument: 09-May-2002; Publisher: Altium Limited; ComponentLink1Description: Manufacturer Link; ComponentLink1URL: http://domino.kycon.com/internet/Products.html
J2 J3 = COAX-F: RF Coaxial PCB Connector, MCX; Thru-Hole, Right-Angle Mount Socket, Blunt Post Terminal, 50 Ohm Impedance; PCB_Layout: Complies with manufacturer's recommendation.; DrillSize: Corresponds to nominal value.; Published: 15-Jul-2004; LatestRevisionDate: 15-Jul-2004; LatestRevisionNote: Component Replaced.; DatasheetDocument: 30-May-2003; PackageDocument: 04-Jul-1999; PackageReference: 919-119J-51AX; Publisher: Altium Limited; ComponentLink1Description: Manufacturer Link; ComponentLink1URL: http://www.amphenolrf.com/
L1 L11 L17-L21 L23 L24 = Inductor Iron: Magnetic-Core Inductor; Published: 24-Mar-1999; LatestRevisionDate: 17-Jul-2002; LatestRevisionNote: Re-released for DXP Platform.; PackageReference: AXIAL-0.9; Publisher: Altium Limited
L2-L10 L12-L15 L22 = H
L25 = Inductor: Code_IEC: 1005; Published: 8-Jun-2000; LatestRevisionDate: 29-May-2009; LatestRevisionNote: IPC-7351 Footprint Added.; PackageReference: 0402-A; Publisher: Altium Limited; PackageDescription: Chip Inductor; Code_JEITA: 0402
LL1 LL2 = Trans CT: Center-Tapped Transformer (Coupled Inductor Model); Published: 8-Jun-2000; LatestRevisionDate: 17-Jul-2002; LatestRevisionNote: Re-released for DXP Platform.; PackageReference: TRF_5; Publisher: Altium Limited
P1 P7 = Header 2: Header, 2-Pin; LatestRevisionDate: 17-Jul-2002; LatestRevisionNote: Re-released for DXP Platform.; Publisher: Altium Limited
P2 P4 = Header 5X2: Header, 5-Pin, Dual row; LatestRevisionDate: 17-Jul-2002; LatestRevisionNote: Re-released for DXP Platform.; Publisher: Altium Limited
P3 = Header 3: Header, 3-Pin; LatestRevisionDate: 17-Jul-2002; LatestRevisionNote: Re-released for DXP Platform.; Publisher: Altium Limited
P5 PP1 PP2 = Header 4: Header, 4-Pin; LatestRevisionDate: 17-Jul-2002; LatestRevisionNote: Re-released for DXP Platform.; Publisher: Altium Limited
P10 = Header 30: Header, 30-Pin; LatestRevisionDate: 17-Jul-2002; LatestRevisionNote: Re-released for DXP Platform.; Publisher: Altium Limited
R1-R55 R57-R64 = RES
T1 T2 = SPX29300T
T3 T4 = 117
U4 = EP2C8Q208C8: Cyclone II Family, 1.2V FPGA, 138 I/O Pins, 2 PLLs, 208-Pin PQFP, Speed Grade 8, Commercial Grade; Note: DQS signal pins named according to DQ bus modes.  "/" separates each mode. ie. Modes x8/x9 / Modes x16/x18.; Published: 4-Mar-2005; LatestRevisionDate: 14-May-2007; LatestRevisionNote: DATA0 pin is now INPUT.; DatasheetVersion: ver3.3, Feb-2008; PackageVersion: ver15.4, Dec-2008; PackageReference: PQFP208; Publisher: Altium Limited; PackageDescription: 208-Pin Plastic Quad Flat Pack (PQFP208) - Wire Bond; Code_JEDEC: MS-029-FA-1; ComponentLink1Description: Manufacturer Link; ComponentLink1URL: http://www.altera.com/products/devices/cyclone2/cy2-index.jsp; ComponentLink2Description: Handbook; ComponentLink2URL: http://www.altera.com/literature/hb/cyc2/cyc2_cii5v1.pdf; ComponentLink3Description: Packaging Specification; ComponentLink3URL: http://www.altera.com/literature/ds/dspkg.pdf
U6 = EPCS4SI8N: EPCS4 Series, In-system programmable 3.3V serial configuration device, 8-Pin SOIC, 4-Megabit, Industrial Grade, Pb-Free; Configures: Cyclone II, Stratix II, & Cyclone Devices; Published: 4-Mar-2005; LatestRevisionDate: 13-Apr-2006; LatestRevisionNote: IPC-7351 Footprint Added.; DatasheetVersion: ver2.0, Oct-2003; PackageVersion: ver13.0, May-2005; PackageReference: SOIC8; Publisher: Altium Limited; PackageDescription: 8-Pin Small Outline Integrated Circuit Package (SOIC8); Code_JEDEC: MS-012-AA; Code_IPC: SOIC127P600-8; ComponentLink1Description: Manufacturer Link; ComponentLink1URL: http://www.altera.com/products/devices/config/cfg-index.html; ComponentLink2Description: Configuration Handbook; ComponentLink2URL: http://www.altera.com/literature/hb/cfg/config_handbook.pdf; ComponentLink3Description: Pinout Specification; ComponentLink3URL: http://www.altera.com/literature/hb/cfg/cyc_c51014.pdf; ComponentLink4Description: Packaging Specification; ComponentLink4URL: http://www.altera.com/literature/ds/dspkg.pdf
U7 = STM32F101V8T6: STM32 ARM-based 32-bit MCU with 64 Kbytes Flash, 100-pin LQFP, Industrial Temperature; Published: 30-May-2008; DatasheetVersion: rev6, Mar-2008; PackageVersion: Mar-2008; PackageReference: LQFP100; Publisher: Altium Limited; PackageDescription: 100-Pin Low-Profile Quad Flat Pack, 14 x 14 mm Body, 0.5 mm Pitch (LQFP100); ComponentLink1Description: Manufacturer Link; ComponentLink1URL: www.st.com/stm32; ComponentLink2Description: Datasheet; ComponentLink2URL: http://www.st.com/stonline/products/literature/ds/13586.pdf
Y2 = XTAL: Crystal Oscillator; Published: 8-Jun-2000; LatestRevisionDate: 17-Jul-2002; LatestRevisionNote: Re-released for DXP Platform.; PackageReference: R38; Publisher: Altium Limited